# EAGLE design chroma-pcb-nramakri2 (EAGLE 7.5.0)
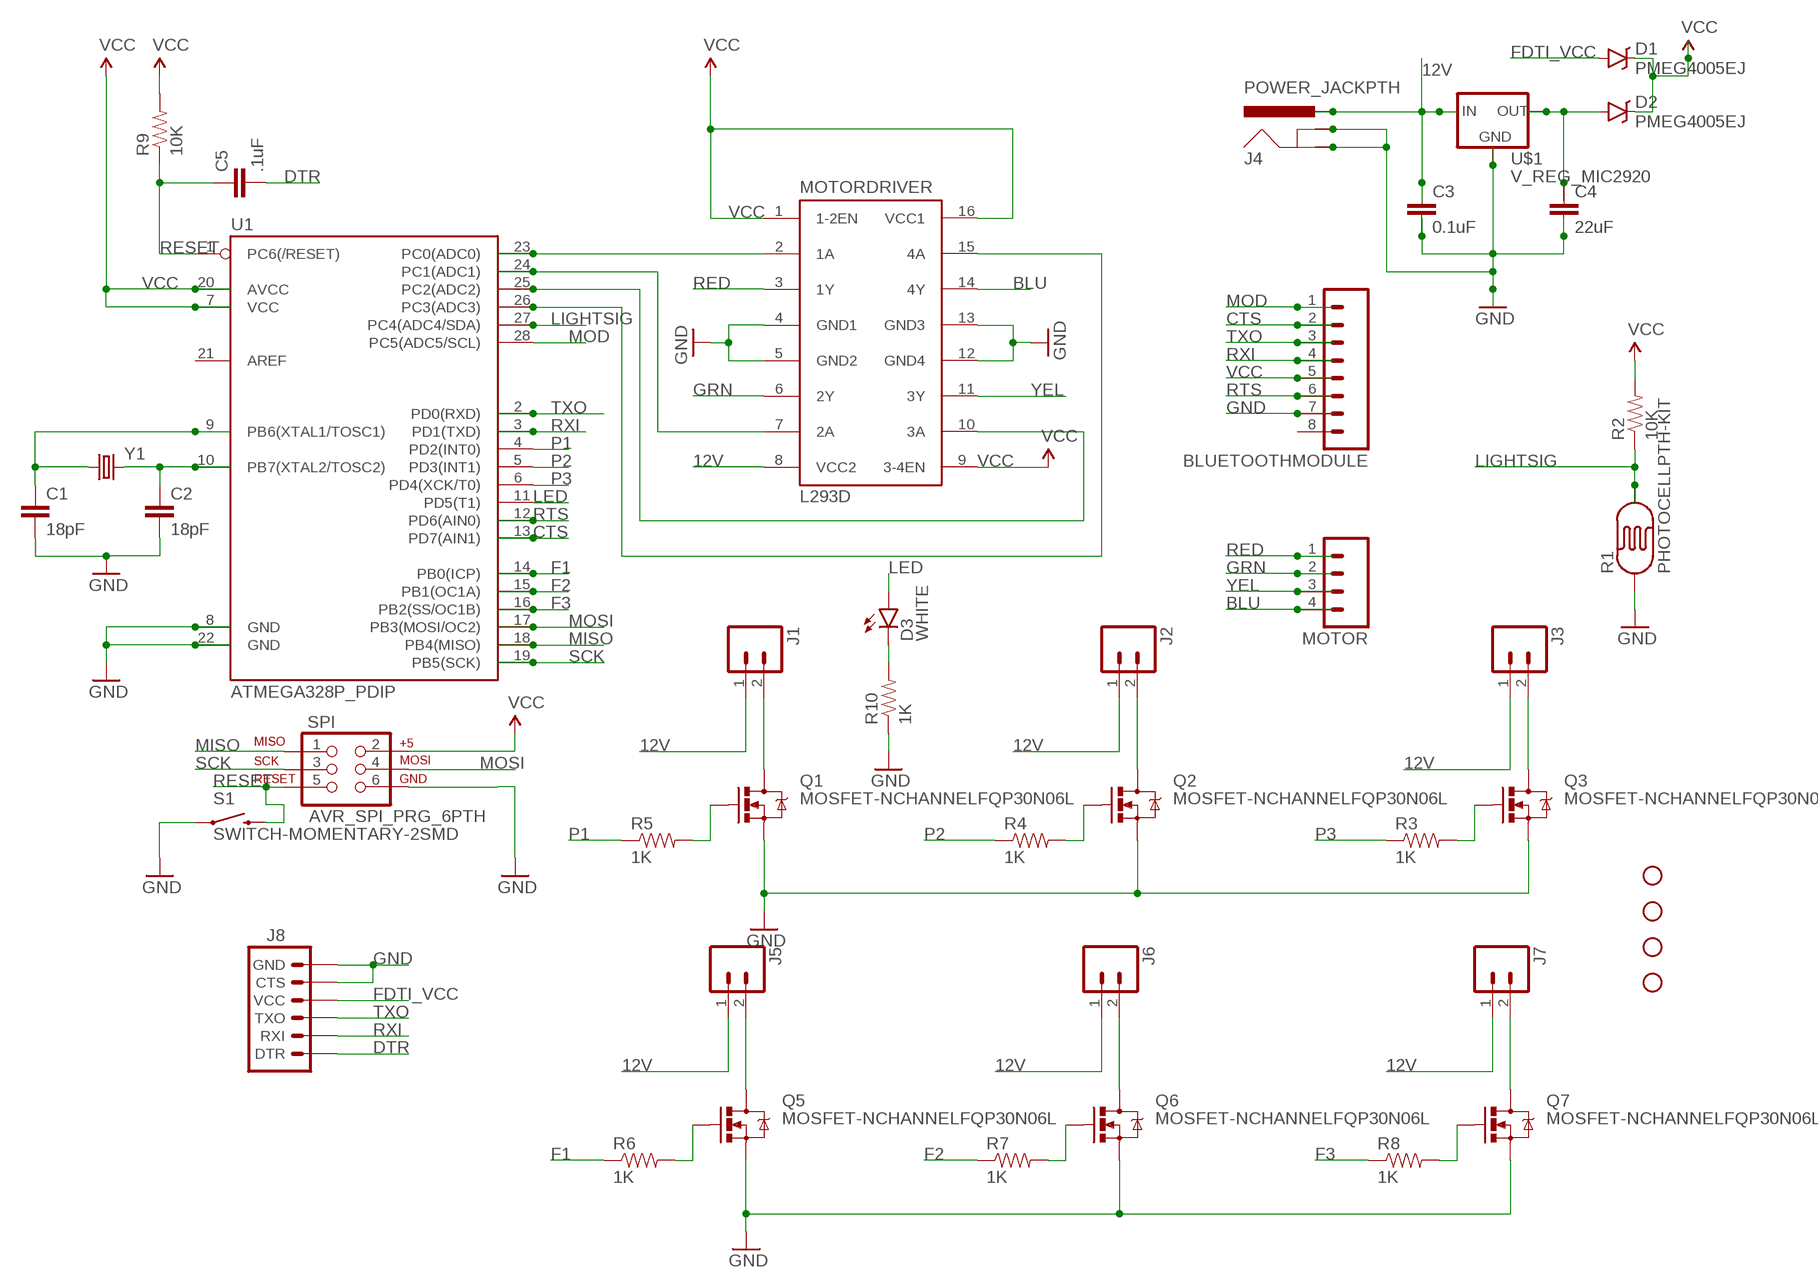
[diagram p0: schematic, sheet 1]

## Parts
BLUETOOTHMODULE  M08  [1X08_ROUND]
C1  18pF  CAP1206  [1206]
C2  18pF  CAP1206  [1206]
C3  0.1uF  CAP1206  [1206]
C4  22uF  CAP1206  [1206]
C5  .1uF  CAP1206  [1206]
D1  PMEG4005EJ  DIODE-SCHOTTKY-PMEG4005EJ  [SOD-323]
D2  PMEG4005EJ  DIODE-SCHOTTKY-PMEG4005EJ  [SOD-323]
D3  WHITE  LED5MM  [LED5MM]
H1  STAND-OFF  [STAND-OFF]
H2  STAND-OFF  [STAND-OFF]
H3  STAND-OFF  [STAND-OFF]
H4  STAND-OFF  [STAND-OFF]
J1  M023.5MM  [SCREWTERMINAL-3.5MM-2]
J2  M023.5MM  [SCREWTERMINAL-3.5MM-2]
J3  M023.5MM  [SCREWTERMINAL-3.5MM-2]
J4  POWER_JACKPTH  [POWER_JACK_PTH]
J5  M023.5MM  [SCREWTERMINAL-3.5MM-2]
J6  M023.5MM  [SCREWTERMINAL-3.5MM-2]
J7  M023.5MM  [SCREWTERMINAL-3.5MM-2]
J8  ARDUINO_SERIAL_PROGRAMPTH  [1X06]
MOTOR  M04PTH  [1X04]
MOTORDRIVER  L293D  [DIL16]
Q1  MOSFET-NCHANNELFQP30N06L  [TO220V]
Q2  MOSFET-NCHANNELFQP30N06L  [TO220V]
Q3  MOSFET-NCHANNELFQP30N06L  [TO220V]
Q5  MOSFET-NCHANNELFQP30N06L  [TO220V]
Q6  MOSFET-NCHANNELFQP30N06L  [TO220V]
Q7  MOSFET-NCHANNELFQP30N06L  [TO220V]
R1  PHOTOCELLPTH-KIT  [PHOTOCELL-KIT]
R2  10K  RESISTOR1206  [1206]
R3  1K  RESISTOR1206  [1206]
R4  1K  RESISTOR1206  [1206]
R5  1K  RESISTOR1206  [1206]
R6  1K  RESISTOR1206  [1206]
R7  1K  RESISTOR1206  [1206]
R8  1K  RESISTOR1206  [1206]
R9  10K  RESISTOR1206  [1206]
R10  1K  RESISTOR1206  [1206]
S1  SWITCH-MOMENTARY-2SMD  [TACTILE-SWITCH-SMD]
SPI  AVR_SPI_PRG_6PTH  [2X3]
U1  ATMEGA328P_PDIP  [DIL28-3]
U$1  V_REG_MIC2920  [SOT223]
Y1  CRYSTALTXC-7A  [CRYSTAL-TXC-7A]

## Nets
12V: C3.1 J1.1 J2.1 J3.1 J4.PWR J5.1 J6.1 J7.1 MOTORDRIVER.8(VCC2) U$1.1(IN)
BLU: MOTOR.4 MOTORDRIVER.14(4Y)
CTS: BLUETOOTHMODULE.2 U1.13(PD7(AIN1))
DTR: C5.2 J8.1(DTR)
F1: R6.1 U1.14(PB0(ICP))
F2: R7.1 U1.15(PB1(OC1A))
F3: R8.1 U1.16(PB2(SS/OC1B))
FDTI_VCC: D1.A J8.4(VCC)
GND: BLUETOOTHMODULE.7 C1.2 C2.2 C3.2 C4.2 J4.GND J4.GNDBREAK J8.5(CTS) J8.6(GND) MOTORDRIVER.4(GND1) MOTORDRIVER.5(GND2) MOTORDRIVER.12(GND4) MOTORDRIVER.13(GND3) Q1.3(S) Q2.3(S) Q3.3(S) Q5.3(S) Q6.3(S) Q7.3(S) R1.1 R10.1 S1.1 SPI.6 U1.8(GND) U1.22(GND) U$1.2(GND)
GRN: MOTOR.2 MOTORDRIVER.6(2Y)
LED: D3.A U1.11(PD5(T1))
LIGHTSIG: R1.2 R2.1 U1.27(PC4(ADC4/SDA))
MISO: SPI.1 U1.18(PB4(MISO))
MOD: BLUETOOTHMODULE.1 U1.28(PC5(ADC5/SCL))
MOSI: SPI.4 U1.17(PB3(MOSI/OC2))
N$1: MOTORDRIVER.2(1A) U1.23(PC0(ADC0))
N$2: MOTORDRIVER.7(2A) U1.24(PC1(ADC1))
N$3: MOTORDRIVER.10(3A) U1.25(PC2(ADC2))
N$4: MOTORDRIVER.15(4A) U1.26(PC3(ADC3))
N$5: D3.K(C) R10.2
N$6: C2.1 U1.10(PB7(XTAL2/TOSC2)) Y1.P$2
N$7: Q1.1(G) R5.2
N$8: C4.1 D2.A U$1.3(OUT)
N$9: Q5.1(G) R6.2
N$10: Q6.1(G) R7.2
N$11: Q7.1(G) R8.2
N$12: C1.1 U1.9(PB6(XTAL1/TOSC1)) Y1.P$1
N$13: Q3.1(G) R3.2
N$14: Q2.1(G) R4.2
N$21: J5.2 Q5.2(D)
N$26: J1.2 Q1.2(D)
N$27: J2.2 Q2.2(D)
N$28: J3.2 Q3.2(D)
N$30: J6.2 Q6.2(D)
N$33: J7.2 Q7.2(D)
P1: R5.1 U1.4(PD2(INT0))
P2: R4.1 U1.5(PD3(INT1))
P3: R3.1 U1.6(PD4(XCK/T0))
RED: MOTOR.1 MOTORDRIVER.3(1Y)
RESET: C5.1 R9.1 S1.3 SPI.5 U1.1(PC6(/RESET))
RTS: BLUETOOTHMODULE.6 U1.12(PD6(AIN0))
RXI: BLUETOOTHMODULE.4 J8.2(RXI) U1.3(PD1(TXD))
SCK: SPI.3 U1.19(PB5(SCK))
TXO: BLUETOOTHMODULE.3 J8.3(TXO) U1.2(PD0(RXD))
VCC: BLUETOOTHMODULE.5 D1.C D2.C MOTORDRIVER.1(1-2EN) MOTORDRIVER.9(3-4EN) MOTORDRIVER.16(VCC1) R2.2 R9.2 SPI.2 U1.7(VCC) U1.20(AVCC)
YEL: MOTOR.3 MOTORDRIVER.11(3Y)
Unconnected: BLUETOOTHMODULE.8 U1.21(AREF)

## Library data of the parts
BLUETOOTHMODULE = SparkFun-Connectors:M08: Header 8 Standard 8-pin 0.1" header. Use with straight break away headers (SKU : PRT-00116), right angle break away headers (PRT-00553), swiss pins (PRT-00743), machine pins (PRT-00117), and female headers (PRT-00115).; PROD_ID: CONN-08437
C1-C5 = SparkFun-Capacitors:CAP: Capacitor Standard 0603 ceramic capacitor, and 0.1" leaded capacitor.
D1 D2 = SparkFun-DiscreteSemi:DIODE-SCHOTTKY: Schottky diodes in SFE's production catalog BAT20J 1A 23V 0.62Vf RB751 120mA 40V 0.37Vf PMEG4005EJ 0.5A 40V 0.42Vf MBRA140 1A 40V 0.5Vf B340A 3A 40V SMA; PROD_ID: DIO-10955
D3 = SparkFun-LED:LED: LEDs Standard schematic elements and footprints for 5mm, 3mm, 1206, and 0603 sized LEDs. 5mm - Spark Fun Electronics SKU : COM-00529 (and others)
H1-H4 = SparkFun-Electromechanical:STAND-OFF: #4 Stand Off This is the mechanical footprint for a #4 phillips button head screw. Use the keepout ring to avoid running the screw head into surrounding components. SKU : PRT-00447
J1-J3 J5-J7 = SparkFun-Connectors:M02: Standard 2-pin 0.1" header. Use with - straight break away headers ( PRT-00116) - right angle break away headers (PRT-00553) - swiss pins (PRT-00743) - machine pins (PRT-00117) - female headers (PRT-00115) Molex polarized connector foot print use with: PRT-08233 with associated crimp pins and housings. 2.54_SCREWTERM for use with PRT-10571. 3.5mm Screw Terminal footprints for PRT-08084 5mm Screw Terminal footprints for use with PRT-08432; PROD_ID: CONN-08399
J4 = SparkFun-Connectors:POWER_JACK: Power Jack This is the standard 5.5mm barrel jack for power. The PTH is the most common, proven, reliable, footprint. The Slot footprint only works if the mill layer is transmitted to the PCB fab house so be warned. Mating wall wart : TOL-00298 (and others); PROD_ID: CONN-08197
J8 = SparkFun-Connectors:ARDUINO_SERIAL_PROGRAM: FTDI connector footprints
MOTOR = SparkFun-Connectors:M04: Header 4 Standard 4-pin 0.1" header. Use with straight break away headers (SKU : PRT-00116), right angle break away headers (PRT-00553), swiss pins (PRT-00743), machine pins (PRT-00117), and female headers (PRT-00115). Molex polarized connector foot print use with SKU : PRT-08231 with associated crimp pins and housings. 1MM SMD Version SKU: PRT-10208; PROD_ID: CONN-09696
MOTORDRIVER = st-microelectronics:L293D: PUSH-PULL 4 CHANNEL DRIVER; MPN: L293D; OC_FARNELL: 9589619; OC_NEWARK: 56P8249
Q1-Q3 Q5-Q7 = SparkFun-DiscreteSemi:MOSFET-NCHANNEL: Common NMOSFET Parts MFG P/N Store ID Prod ID FDD8780 TRANS-09984 SI7820DN TRANS-11055 FDS6630A IC-08089 2N7002PW TRANS-11151 FQP30N06L COM-10213 TRANS-10060 BSS123LT1G TRANS-08345 BSS138 TRANS-00830 BS170 2N7000; PROD_ID: TRANS-10060
R1 = SparkFun-Sensors:PHOTOCELL: CdS photoresistor. This is a low cost way to detect light levels. Resistance decreases with more incoming light. SparkFun SKU: SEN-09088
R2-R10 = SparkFun-Passives:RESISTOR: Resistor Basic schematic elements and footprints for 0603, 1206, and PTH resistors.
S1 = SparkFun-Electromechanical:SWITCH-MOMENTARY-2: Various NO switches- pushbuttons, reed, etc; PROD_ID: SWCH-08247
SPI = SparkFun-Connectors:AVR_SPI_PRG_6: AVR ISP 6 Pin This is the reduced ISP connector for AVR programming. Common on Arduino. This footprint will take up less PCB space and can be used with a 10-pin to 6-pin adapter such as SKU: BOB-08508 **Special note about "TEST_POINT" package. The stop mask is on the top side, so if you want your programming test points to be on the bottom of your board, make sure to place this package on the bottom side of the board. This also ensure that the orientation to program from the bottom side will be correct.
U1 = SparkFun-DigitalIC:ATMEGA328P_PDIP: uC used in the Arduino 32kb flash, 1k EEPROM, 2k SRAM This is the through-hole version of this chip.
U$1 = SparkFun-PowerIC:V_REG_MIC2920: MIC2920A (http://www.micrel.com/_PDF/mic2920.pdf) - 400mA output LDO Regulator
Y1 = SparkFun-FreqCtrl:CRYSTAL: Various standard crystals. Proven footprints.

## Board
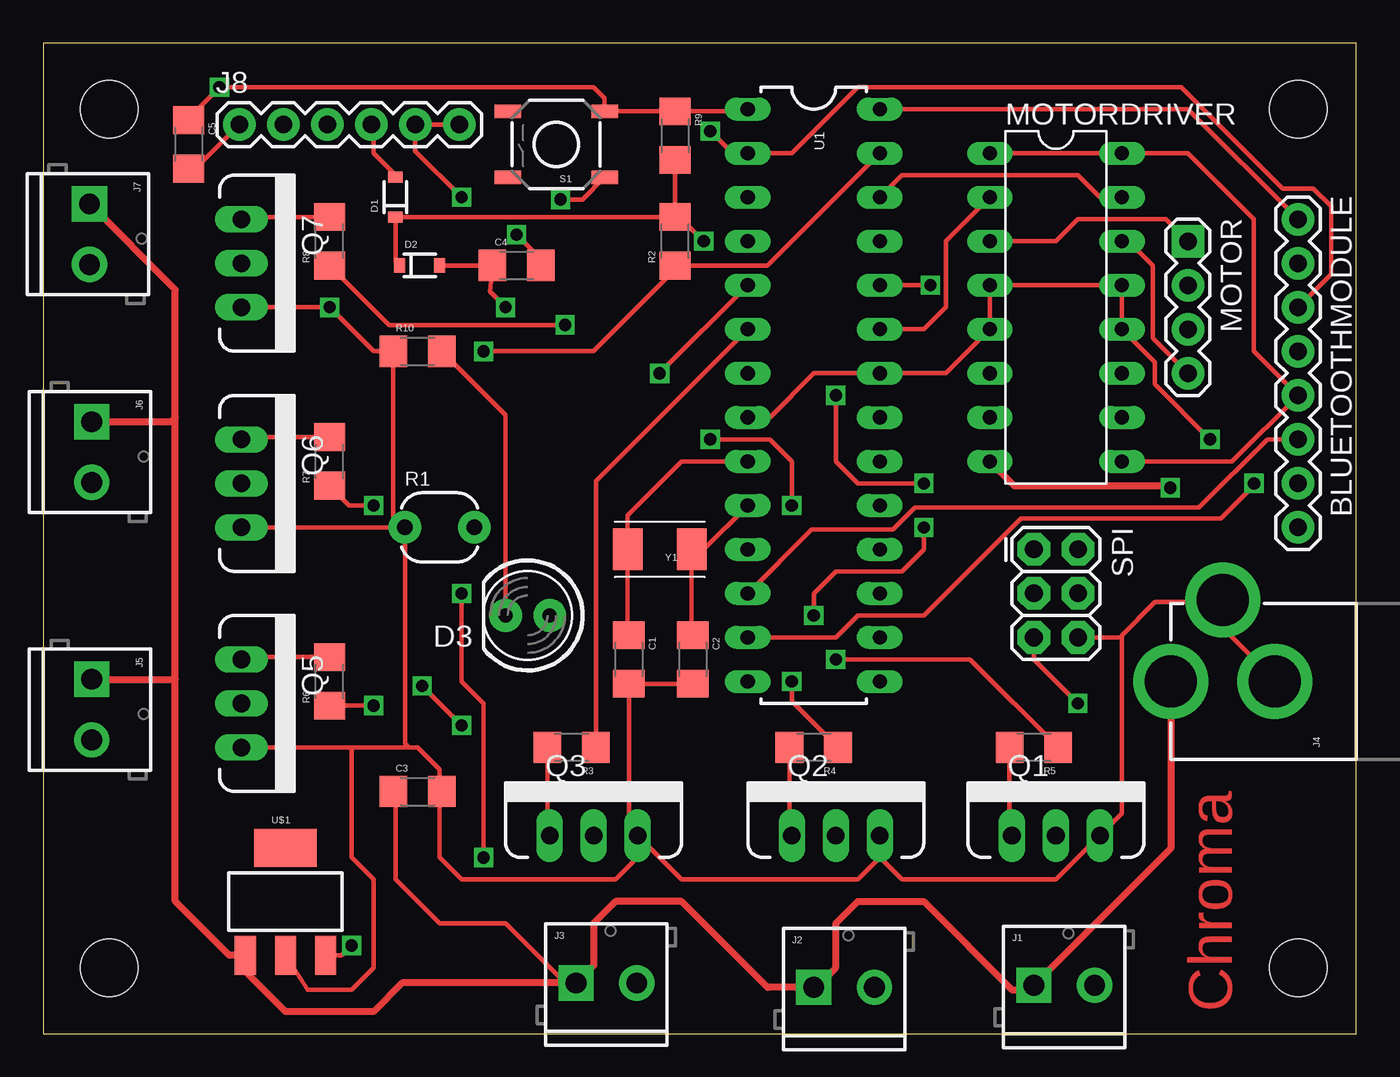
[diagram p1: board, top side]
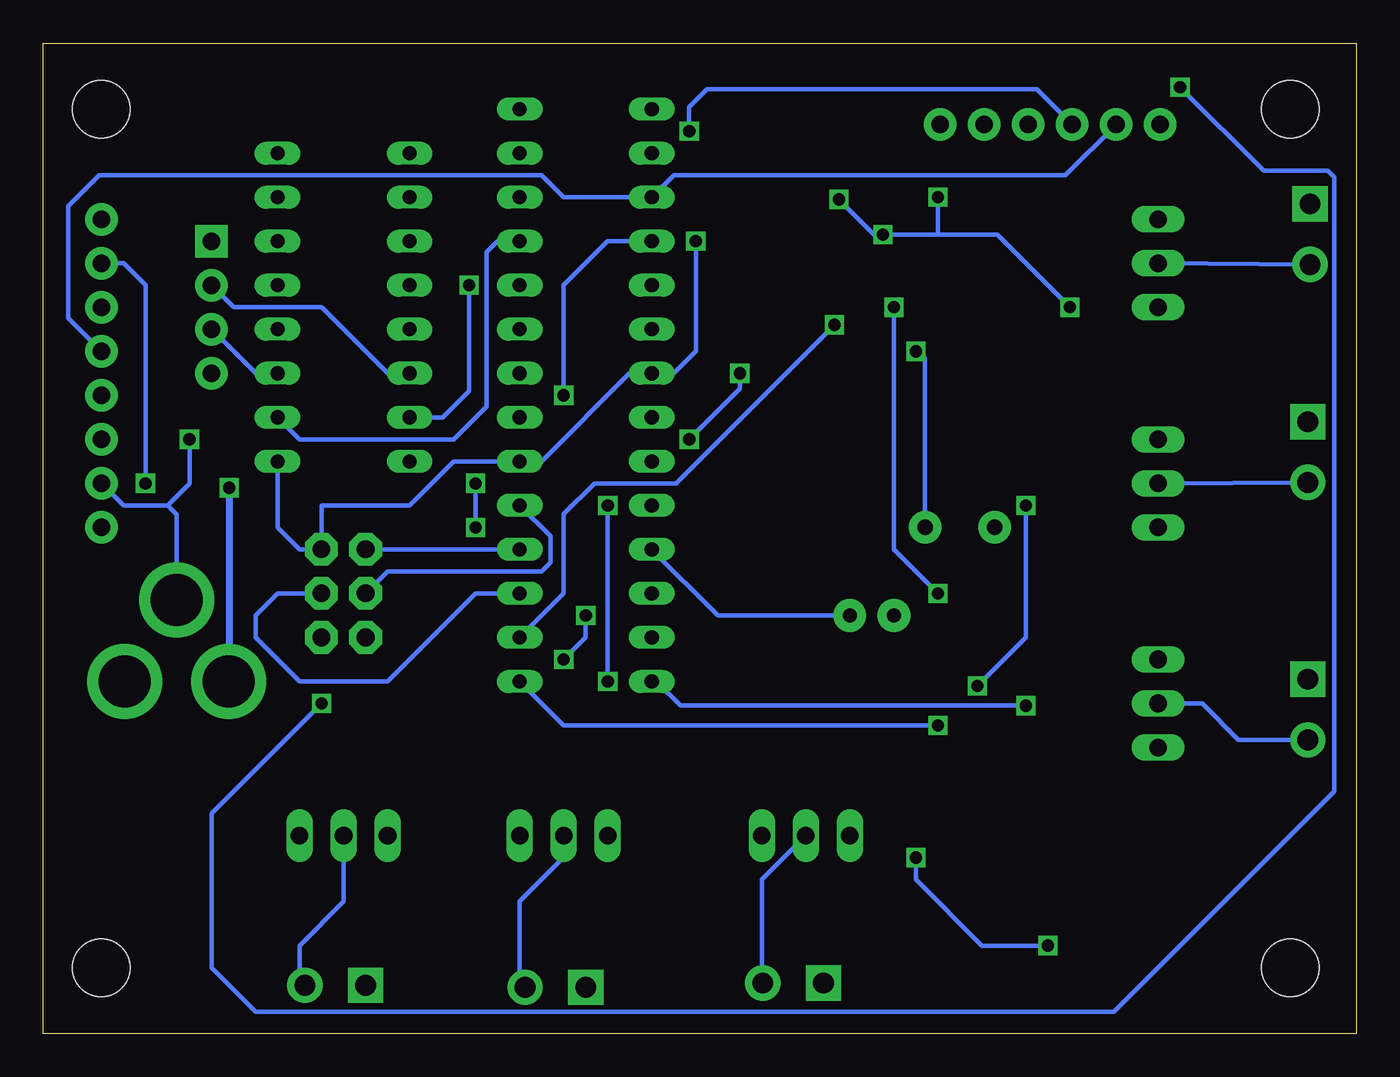
[diagram p2: board, bottom side, seen from below]

Size 75.74 x 57.14 mm. Coordinates in mm from the lower left corner, seen from the top.
Outline: 0,0 75.74,0 75.74,57.14 0,57.14 0,0
Copper layers (1*16): Top 0.035mm / dielectric 1.5mm / Bottom 0.035mm
Design rules "default": minimum track width 10mil, minimum drill 24mil, track to track 8mil, track to pad 8mil, pad to pad 8mil, via to via 8mil, smd to smd 8mil, copper to edge 40mil, drill to drill 8mil, minimum pad ring 10mil, minimum via ring 8mil, stop-mask expansion 4mil, vias tented up to drill 0mil, thermal gap 10mil

### Footprints (pad centres in the part's own frame; a part is rotated, then mirrored left to right if it is on the bottom)
1X08_ROUND = drill 1.016 pad 1.88: 1 0,0; 2 2.54,0; 3 5.08,0; 4 7.62,0; 5 10.16,0; 6 12.7,0; 7 15.24,0; 8 17.78,0
1206 = smd 1.6 x 1.8: 1 -1.4,0; 2 1.4,0
SOD-323 = smd 0.63 x 0.83: A 1.15,0; C -1.15,0
LED5MM = drill 0.813 pad 1.88: A -1.27,0; K 1.27,0
STAND-OFF = hole 3.302: 0,0
SCREWTERMINAL-3.5MM-2 = drill 1.2 pad 2.032 square: 1 0,0 | drill 1.2 pad 2.032: 2 3.5,0
POWER_JACK_PTH = drill 2.997 pad 4.318: GND 0,7.7; GNDBREAK 4.7,10.7; PWR 0,13.7
1X06 = drill 1.016 pad 1.88: 1 0,0; 2 2.54,0; 3 5.08,0; 4 7.62,0; 5 10.16,0; 6 12.7,0
1X04 = drill 1.016 pad 1.88 square: 1 0,0 | drill 1.016 pad 1.88: 2 2.54,0; 3 5.08,0; 4 7.62,0
DIL16 = drill 0.813 long: 1 -8.89,-3.81; 2 -6.35,-3.81; 3 -3.81,-3.81; 4 -1.27,-3.81; 5 1.27,-3.81; 6 3.81,-3.81; 7 6.35,-3.81; 8 8.89,-3.81; 9 8.89,3.81; 10 6.35,3.81; 11 3.81,3.81; 12 1.27,3.81; 13 -1.27,3.81; 14 -3.81,3.81; 15 -6.35,3.81; 16 -8.89,3.81
TO220V = drill 1.016 long: 1 -2.54,0; 2 0,0; 3 2.54,0
PHOTOCELL-KIT = drill 0.9 pad 1.88: 1 -2,0; 2 2,0
TACTILE-SWITCH-SMD = smd 1.524 x 0.762: 1 -2.794,1.905; 2 2.794,1.905; 3 -2.794,-1.905; 4 2.794,-1.905
2X3 = drill 1.016 pad 1.88 octagon: 1 0,0; 2 0,2.54; 3 2.54,0; 4 2.54,2.54; 5 5.08,0; 6 5.08,2.54
DIL28-3 = drill 0.813 long: 1 -16.51,-3.81; 2 -13.97,-3.81; 3 -11.43,-3.81; 4 -8.89,-3.81; 5 -6.35,-3.81; 6 -3.81,-3.81; 7 -1.27,-3.81; 8 1.27,-3.81; 9 3.81,-3.81; 10 6.35,-3.81; 11 8.89,-3.81; 12 11.43,-3.81; 13 13.97,-3.81; 14 16.51,-3.81; 15 16.51,3.81; 16 13.97,3.81; 17 11.43,3.81; 18 8.89,3.81; 19 6.35,3.81; 20 3.81,3.81; 21 1.27,3.81; 22 -1.27,3.81; 23 -3.81,3.81; 24 -6.35,3.81; 25 -8.89,3.81; 26 -11.43,3.81; 27 -13.97,3.81; 28 -16.51,3.81
SOT223 = smd 1.219 x 2.235: 1 -2.311,-3.099; 2 0,-3.099; 3 2.311,-3.099 | smd 3.6 x 2.2: 4 0,3.099
CRYSTAL-TXC-7A = smd 1.7 x 2.4: P$1 1.85,0; P$2 -1.85,0

### Placement (x,y rotation side)
BLUETOOTHMODULE  72.39,46.99 270 top
C1  33.78,21.59 270 top
C2  37.47,21.59 270 top
C3  21.59,13.97 0 top
C4  27.3,44.32 0 top
C5  8.38,51.31 270 top
D1  20.32,48.26 90 top
D2  21.72,44.32 0 top
D3  27.94,24.13 180 top
H1  3.81,53.34 0 top
H2  3.81,3.81 0 top
H3  72.39,3.81 0 top
H4  72.39,53.34 0 top
J1  57.15,2.79 0 top
J2  44.45,2.67 0 top
J3  30.73,2.92 0 top
J4  78.74,20.32 90 top
J5  2.79,20.45 270 top
J6  2.79,35.31 270 top
J7  2.67,47.88 270 top
J8  11.3,52.45 0 top
MOTOR  66.04,45.72 270 top
MOTORDRIVER  58.42,41.91 270 top
Q1  58.42,11.43 0 top
Q2  45.72,11.43 0 top
Q3  31.75,11.43 0 top
Q5  11.43,19.05 270 top
Q6  11.43,31.75 270 top
Q7  11.43,44.45 270 top
R1  22.86,29.21 0 top
R2  36.45,45.72 90 top
R3  30.48,16.51 180 top
R4  44.45,16.51 180 top
R5  57.15,16.51 180 top
R6  16.51,20.32 90 top
R7  16.51,33.02 90 top
R8  16.51,45.72 90 top
R9  36.45,51.82 270 top
R10  21.59,39.37 0 top
S1  29.59,51.31 180 top
SPI  57.15,27.94 270 top
U1  44.45,36.83 270 top
U$1  13.97,7.62 0 top
Y1  35.56,27.94 180 top

### Tracks (layer width: path | path; a pad name or v marks a point on that pad's centre or on a via)
12V  (via drill 0.7)
  Top 0.254: J3.1 30.1,2.92 26.67,6.35 22.86,6.35 20.32,8.89 20.32,13.84 C3.1
  Top 0.406: 7.62,20.45 7.62,7.62 10.72,4.52 U$1.1 11.43,4.29 11.43,3.81 13.97,1.27 19.05,1.27 20.7,2.92 J3.1 31.75,3.94 31.75,6.35 33.02,7.62 36.83,7.62 41.78,2.67 J2.1 44.58,2.67 45.72,3.81 45.72,6.35 46.99,7.62 50.8,7.62 55.88,2.54 56.9,2.54 J1.1 65.04,10.68 J4.PWR | 7.62,20.45 7.62,35.56 | J5.1 7.62,20.45 | J6.1 7.37,35.31 7.62,35.56 | MOTORDRIVER.8 56.01,31.62 64.9,31.62 v65.02,31.5 | 7.62,35.56 7.62,42.93 J7.1
  Bottom 0.406: v65.02,31.5 65.02,20.34 J4.PWR
BLU
  Top 0.254: MOTORDRIVER.14 62.61,45.72 64.01,44.32 64.01,40.13 MOTOR.4
CTS  (via drill 0.7)
  Top 0.254: v69.85,31.75 69.85,31.62 67.94,29.72 56.39,29.72 50.8,24.13 46.99,24.13 45.72,22.86 U1.13
  Bottom 0.254: BLUETOOTHMODULE.2 71.12,44.45 69.85,43.18 v69.85,31.75
DTR
  Top 0.254: C5.2 8.76,49.91 J8.1
F1  (via drill 0.7)
  Top 0.254: v19.05,18.92 R6.1
  Bottom 0.254: U1.14 40.39,20.32 38.99,18.92 v19.05,18.92
F2  (via drill 0.7)
  Top 0.254: v24.13,17.78 v21.84,20.07 | v19.05,30.48 17.65,30.48 R7.1
  Bottom 0.254: U1.15 45.72,17.78 v24.13,17.78 | v21.84,20.07 19.05,22.86 v19.05,30.48
F3  (via drill 0.7)
  Top 0.254: R8.1 19.94,40.89 v30.1,40.89 29.97,41.02
  Bottom 0.254: U1.16 45.72,25.4 45.72,29.97 43.94,31.75 39.24,31.75 v30.1,40.89
FDTI_VCC
  Top 0.254: D1.A 20.32,49.53 19.05,50.8 19.05,52.32 J8.4
GND  (via drill 0.7)
  Top 0.254: C2.2 C1.2 33.78,11.94 Q3.3 | SPI.6 62.23,22.86 | 17.78,16.51 17.78,10.16 19.05,8.89 19.05,3.81 17.78,2.54 15.24,2.54 U$1.2 | 62.23,22.86 62.23,22.99 64.14,24.89 68.04,24.89 J4.GNDBREAK 68.04,23.4 71.12,20.32 J4.GND | Q5.3 17.78,16.51 | Q3.3 34.29,10.16 33.02,8.89 24.13,8.89 22.86,10.16 22.86,13.84 | 22.86,13.84 C3.2 | 48.26,10.16 46.99,8.89 36.83,8.89 Q3.3 | Q2.3 48.26,10.16 | 48.26,10.16 49.53,8.89 58.42,8.89 Q1.3 62.23,12.7 62.23,22.86 | Q6.3 R1.1 | R1.1 20.32,29.21 | 22.86,13.84 22.86,15.24 21.59,16.51 21.08,16.51 | 21.08,16.51 17.78,16.51 | R1.1 20.86,16.73 21.08,16.51 | R1.1 20.19,29.88 R10.1 19.05,39.37 v16.51,41.91 Q7.3 | C4.2 28.58,44.83 v27.3,46.1 | v67.31,34.29 64.14,37.47 64.14,38.73 MOTORDRIVER.12 MOTORDRIVER.13 MOTORDRIVER.4 MOTORDRIVER.5 52.07,38.1 U1.22 44.45,38.1 41.91,35.56 U1.8 | v29.84,48.13 31.11,48.13 S1.1 | J8.6 J8.5 21.46,50.93 v24.13,48.26
  Bottom 0.254: 24.13,46.1 v27.3,46.1 27.81,46.1 v29.84,48.13 | 24.13,46.1 20.7,46.1 v16.51,41.91 | v67.31,34.29 67.31,31.75 68.58,30.48 | 68.58,30.48 71.12,30.48 BLUETOOTHMODULE.7 | J4.GNDBREAK 68.04,29.94 68.58,30.48 | v24.13,48.26 24.13,46.1
GRN
  Bottom 0.254: MOTORDRIVER.6 55.88,38.1 59.69,41.91 64.77,41.91 MOTOR.2
LED
  Bottom 0.254: D3.A 36.83,24.13 U1.11
LIGHTSIG  (via drill 0.7)
  Top 0.254: U1.27 41.78,44.32 R2.1 36.45,44.07 31.75,39.37 v25.4,39.37
  Bottom 0.254: v25.4,39.37 25.27,39.37 24.89,38.99 24.89,29.24 R1.2
MISO
  Bottom 0.254: U1.18 SPI.1
MOD
  Top 0.254: U1.28 66.04,53.34 BLUETOOTHMODULE.1
MOSI
  Bottom 0.254: U1.17 50.8,25.4 55.88,20.32 60.96,20.32 63.5,22.86 63.5,24.13 62.23,25.4 SPI.4
N$1
  Top 0.254: U1.23 50.8,40.64 52.07,41.91 52.07,45.72 MOTORDRIVER.2
N$2  (via drill 0.7)
  Top 0.254: v51.18,43.18 U1.24
  Bottom 0.254: MOTORDRIVER.7 52.7,35.56 51.18,37.08 v51.18,43.18
N$3
  Bottom 0.254: U1.25 49.53,45.72 50.16,45.09 50.16,36.2 52.07,34.29 60.96,34.29 MOTORDRIVER.10
N$4
  Top 0.254: MOTORDRIVER.15 60.96,48.26 59.69,49.53 49.53,49.53 U1.26
N$5
  Top 0.254: D3.K 26.67,35.69 R10.2
N$6
  Top 0.254: U1.10 38.1,27.94 Y1.P$2 37.41,23.05 C2.1
N$7
  Top 0.254: R5.2 55.75,11.56 Q1.1
N$8  (via drill 0.7)
  Top 0.254: D2.A C4.1 25.78,42.8 v26.67,41.91 | U$1.3 17.22,4.52 v17.78,5.08 | v24.13,25.4 24.13,20.32 25.4,19.05 v25.4,10.16
  Bottom 0.254: v17.78,5.08 21.59,5.08 25.4,8.89 v25.4,10.16 | v26.67,41.91 26.67,27.94 v24.13,25.4
N$9
  Top 0.254: R6.2 11.56,21.72 Q5.1
N$10
  Top 0.254: R7.2 11.56,34.42 Q6.1
N$11
  Top 0.254: R8.2 11.56,47.12 Q7.1
N$12
  Top 0.254: U1.9 36.83,33.02 33.71,29.9 Y1.P$1 33.71,23.06 C1.1
N$13
  Top 0.254: R3.2 29.08,11.56 Q3.1
N$14
  Top 0.254: R4.2 43.05,11.56 Q2.1
N$21
  Bottom 0.254: J5.2 6.79,16.95 8.89,19.05 Q5.2
N$26
  Bottom 0.254: Q1.2 58.42,7.62 60.96,5.08 60.96,3.1 J1.2
N$27
  Bottom 0.254: Q2.2 45.72,10.16 48.26,7.62 48.26,2.98 J2.2
N$28
  Bottom 0.254: Q3.2 34.29,8.89 34.29,2.98 J3.2
N$30
  Bottom 0.254: J6.2 Q6.2
N$33
  Bottom 0.254: J7.2 Q7.2
P1  (via drill 0.7)
  Top 0.254: v45.72,36.83 45.72,33.02 46.99,31.75 v50.8,31.75 | v50.8,29.21 50.8,27.94 49.53,26.67 45.72,26.67 44.45,25.4 v44.45,24.13 | v45.72,21.59 53.47,21.59 R5.1
  Bottom 0.254: U1.4 43.18,45.72 45.72,43.18 v45.72,36.83 | v50.8,31.75 v50.8,29.21 | v44.45,24.13 44.45,22.86 v45.72,21.59
P2  (via drill 0.7)
  Top 0.254: U1.5 v35.56,38.1 | v38.48,34.29 41.91,34.29 43.18,33.02 v43.18,30.48 | v43.18,20.32 43.18,19.18 R4.1
  Bottom 0.254: v35.56,38.1 35.56,37.21 v38.48,34.29 | v43.18,30.48 v43.18,20.32
P3
  Top 0.254: R3.1 31.88,31.88 U1.6
RED
  Top 0.254: MOTORDRIVER.3 58.42,45.72 59.69,46.99 64.77,46.99 MOTOR.1
RESET  (via drill 0.7)
  Top 0.254: U1.1 40.52,53.22 R9.1 S1.3 32.38,53.98 31.75,54.61 v10.16,54.61 8.38,52.83 C5.1 | SPI.5 57.15,21.59 v59.69,19.05
  Bottom 0.254: v59.69,19.05 66.04,12.7 66.04,3.81 63.5,1.27 13.97,1.27 1.27,13.97 1.27,49.4 1.65,49.78 5.33,49.78 v10.16,54.61
RTS
  Top 0.254: BLUETOOTHMODULE.6 70.61,34.29 66.67,30.35 50.29,30.35 49.02,29.08 44.32,29.08 U1.12
RXI
  Bottom 0.254: BLUETOOTHMODULE.4 74.3,41.27 74.3,47.75 72.52,49.53 46.99,49.53 45.72,48.26 U1.3 39.37,49.53 16.76,49.53 J8.2
SCK
  Bottom 0.254: U1.19 46.48,28.7 46.48,27.18 46.99,26.67 55.88,26.67 SPI.3
TXO  (via drill 0.7)
  Top 0.254: BLUETOOTHMODULE.3 74.3,43.81 74.3,47.75 73.28,48.77 71.5,48.77 65.66,54.61 46.99,54.61 43.18,50.8 U1.2 39.75,50.8 v38.48,52.07
  Bottom 0.254: v38.48,52.07 38.48,53.47 37.47,54.48 18.41,54.48 J8.3
VCC  (via drill 0.7)
  Top 0.254: MOTORDRIVER.1 MOTORDRIVER.16 66.04,50.8 69.85,46.99 69.85,39.37 BLUETOOTHMODULE.5 68.58,33.02 MOTORDRIVER.9 | R2.2 D1.C 20.32,44.57 D2.C | R9.2 R2.2 | v38.1,45.72 36.83,46.99 36.58,46.99 R2.2
  Bottom 0.254: MOTORDRIVER.9 62.23,29.21 60.96,27.94 SPI.2 59.69,30.48 54.61,30.48 52.07,33.02 U1.20 46.99,33.02 41.91,38.1 U1.7 39.37,38.1 38.1,39.37 v38.1,45.72
YEL
  Bottom 0.254: MOTORDRIVER.11 63.5,38.1 MOTOR.3

### Text on the board
Top: Chroma